# EAGLE board C64_2 (EAGLE 5.12)
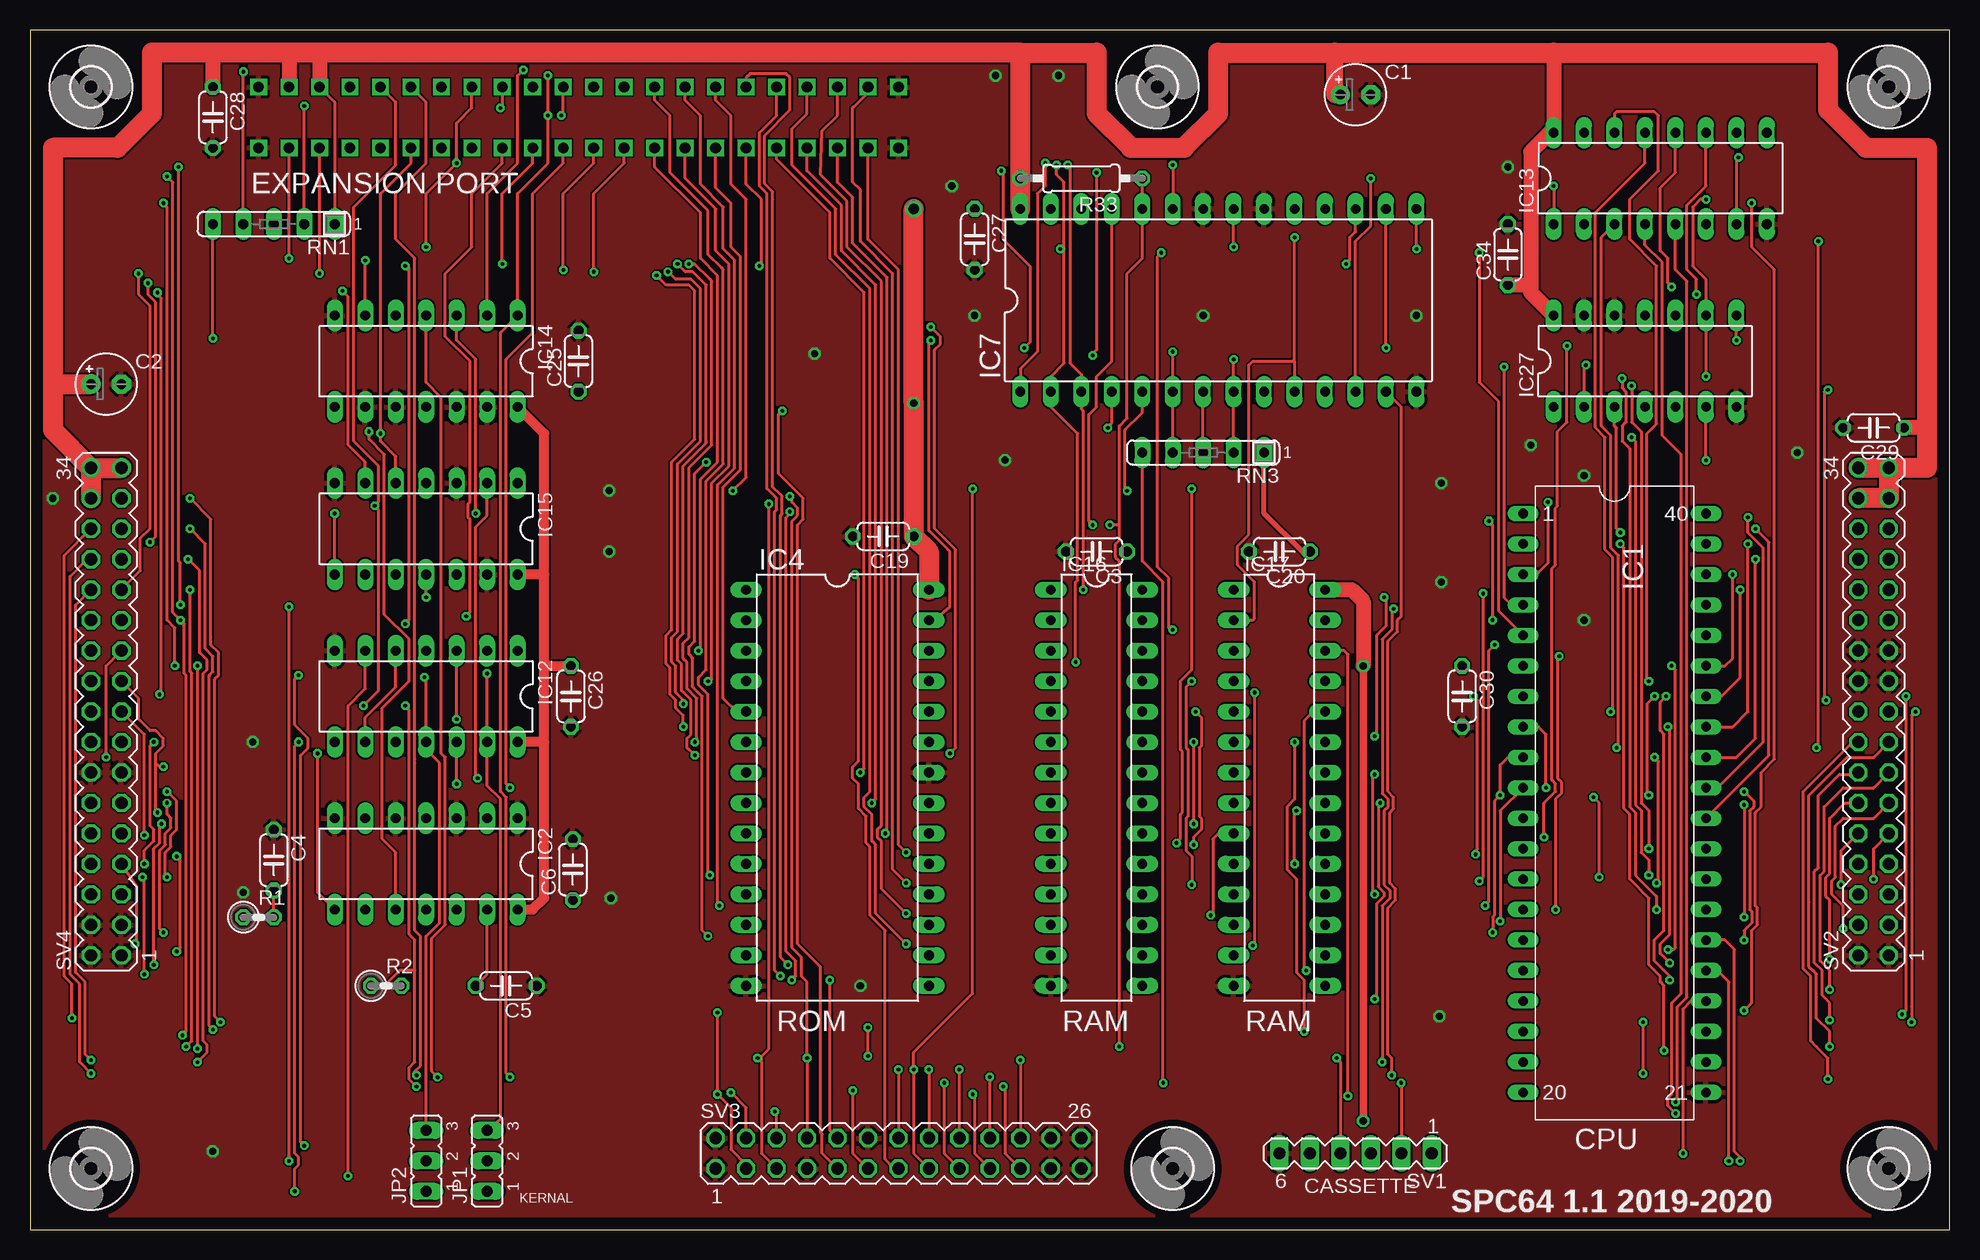
[diagram p5: board, top side]
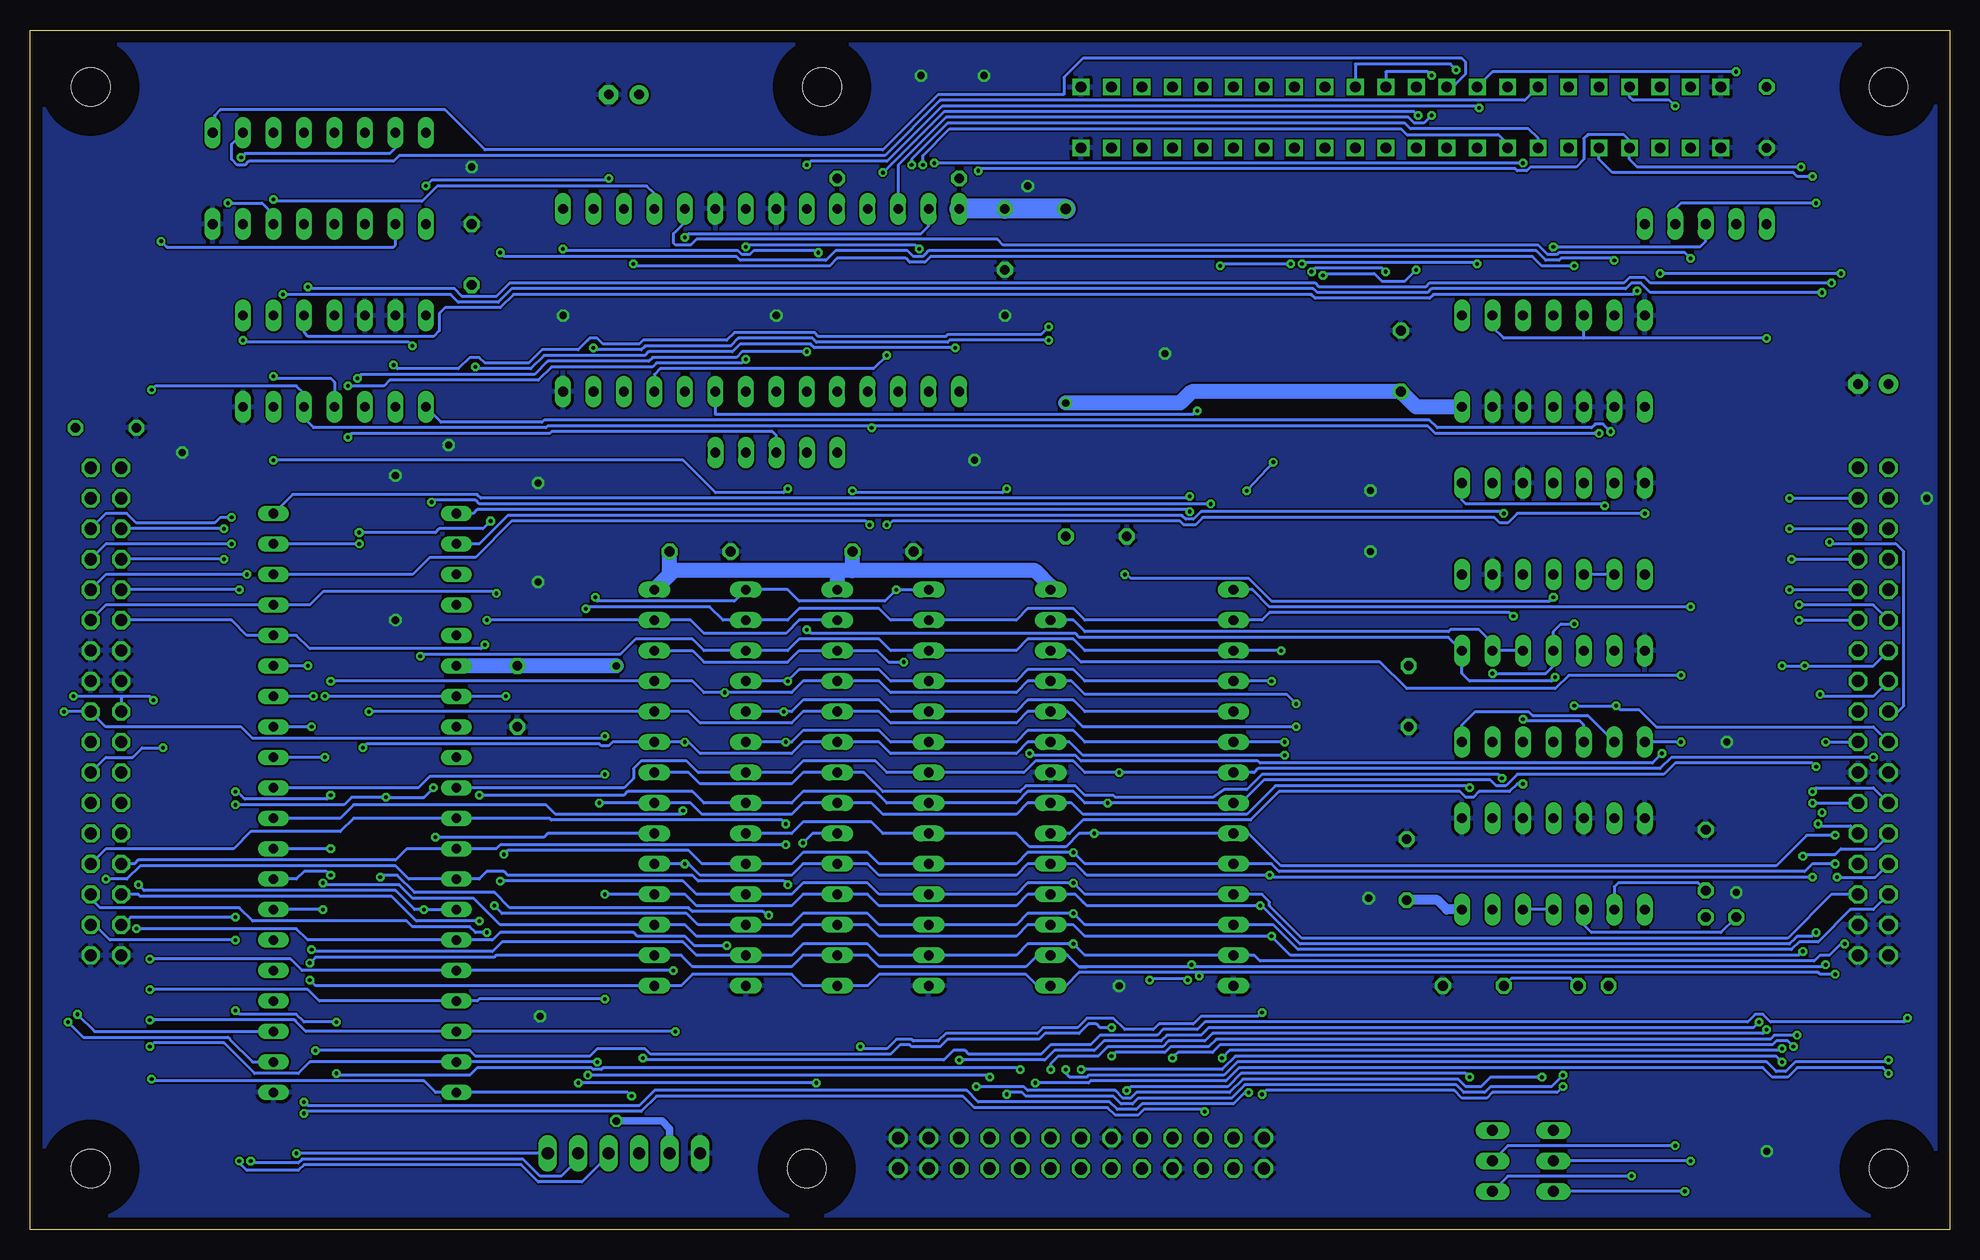
[diagram p6: board, bottom side, seen from below]

Size 160 x 100 mm. Coordinates in mm from the lower left corner, seen from the top.
Outline: 0,0 160,0 160,100 0,100 0,0
Copper layers (1*16): Top 0.035mm / dielectric 1.5mm / Bottom 0.035mm
Design rules "default *": minimum track width 10mil, minimum drill 12mil, track to track 6mil, track to pad 6mil, pad to pad 6mil, via to via 6mil, smd to smd 6mil, copper to edge 40mil, drill to drill 8mil, minimum pad ring 10mil, minimum via ring 8mil, stop-mask expansion 4mil, vias tented up to drill 0mil, thermal gap 10mil

## Footprints (pad centres in the part's own frame; a part is rotated, then mirrored left to right if it is on the bottom)
E2,5-5 = drill 0.813 pad 1.6 round: + -1.27,0 | drill 0.813 pad 1.6 octagon: - 1.27,0
C050-024X044 = drill 0.813 octagon: 1 -2.54,0; 2 2.54,0
EXPANSIONPORT = drill 0.9 square: 1 -26.67,2.54; 2 -24.13,2.54; 3 -21.59,2.54; 4 -19.05,2.54; 5 -16.51,2.54; 6 -13.97,2.54; 7 -11.43,2.54; 8 -8.89,2.54; 9 -6.35,2.54; 10 -3.81,2.54; 11 -1.27,2.54; 12 1.27,2.54; 13 3.81,2.54; 14 6.35,2.54; 15 8.89,2.54; 16 11.43,2.54; 17 13.97,2.54; 18 16.51,2.54; 19 19.05,2.54; 20 21.59,2.54; 21 24.13,2.54; 22 26.67,2.54; A -26.67,-2.54; B -24.13,-2.54; C -21.59,-2.54; D -19.05,-2.54; E -16.51,-2.54; F -13.97,-2.54; H -11.43,-2.54; J -8.89,-2.54; K -6.35,-2.54; L -3.81,-2.54; M -1.27,-2.54; N 1.27,-2.54; P 3.81,-2.54; R 6.35,-2.54; S 8.89,-2.54; T 11.43,-2.54; U 13.97,-2.54; V 16.51,-2.54; W 19.05,-2.54; X 21.59,-2.54; Y 24.13,-2.54; Z 26.67,-2.54
DIP40 = drill 0.8 pad 1.27 long: 1 -24.13,-7.62; 2 -21.59,-7.62; 3 -19.05,-7.62; 4 -16.51,-7.62; 5 -13.97,-7.62; 6 -11.43,-7.62; 7 -8.89,-7.62; 8 -6.35,-7.62; 9 -3.81,-7.62; 10 -1.27,-7.62; 11 1.27,-7.62; 12 3.81,-7.62; 13 6.35,-7.62; 14 8.89,-7.62; 15 11.43,-7.62; 16 13.97,-7.62; 17 16.51,-7.62; 18 19.05,-7.62; 19 21.59,-7.62; 20 24.13,-7.62; 21 24.13,7.62; 22 21.59,7.62; 23 19.05,7.62; 24 16.51,7.62; 25 13.97,7.62; 26 11.43,7.62; 27 8.89,7.62; 28 6.35,7.62; 29 3.81,7.62; 30 1.27,7.62; 31 -1.27,7.62; 32 -3.81,7.62; 33 -6.35,7.62; 34 -8.89,7.62; 35 -11.43,7.62; 36 -13.97,7.62; 37 -16.51,7.62; 38 -19.05,7.62; 39 -21.59,7.62; 40 -24.13,7.62
DIL14 = drill 0.813 long: 1 -7.62,-3.81; 2 -5.08,-3.81; 3 -2.54,-3.81; 4 0,-3.81; 5 2.54,-3.81; 6 5.08,-3.81; 7 7.62,-3.81; 8 7.62,3.81; 9 5.08,3.81; 10 2.54,3.81; 11 0,3.81; 12 -2.54,3.81; 13 -5.08,3.81; 14 -7.62,3.81
DIL28 = drill 0.813 long: 1 -16.51,-7.62; 2 -13.97,-7.62; 3 -11.43,-7.62; 4 -8.89,-7.62; 5 -6.35,-7.62; 6 -3.81,-7.62; 7 -1.27,-7.62; 8 1.27,-7.62; 9 3.81,-7.62; 10 6.35,-7.62; 11 8.89,-7.62; 12 11.43,-7.62; 13 13.97,-7.62; 14 16.51,-7.62; 15 16.51,7.62; 16 13.97,7.62; 17 11.43,7.62; 18 8.89,7.62; 19 6.35,7.62; 20 3.81,7.62; 21 1.27,7.62; 22 -1.27,7.62; 23 -3.81,7.62; 24 -6.35,7.62; 25 -8.89,7.62; 26 -11.43,7.62; 27 -13.97,7.62; 28 -16.51,7.62
DIL16 = drill 0.813 long: 1 -8.89,-3.81; 2 -6.35,-3.81; 3 -3.81,-3.81; 4 -1.27,-3.81; 5 1.27,-3.81; 6 3.81,-3.81; 7 6.35,-3.81; 8 8.89,-3.81; 9 8.89,3.81; 10 6.35,3.81; 11 3.81,3.81; 12 1.27,3.81; 13 -1.27,3.81; 14 -3.81,3.81; 15 -6.35,3.81; 16 -8.89,3.81
DIL28-3 = drill 0.813 long: 1 -16.51,-3.81; 2 -13.97,-3.81; 3 -11.43,-3.81; 4 -8.89,-3.81; 5 -6.35,-3.81; 6 -3.81,-3.81; 7 -1.27,-3.81; 8 1.27,-3.81; 9 3.81,-3.81; 10 6.35,-3.81; 11 8.89,-3.81; 12 11.43,-3.81; 13 13.97,-3.81; 14 16.51,-3.81; 15 16.51,3.81; 16 13.97,3.81; 17 11.43,3.81; 18 8.89,3.81; 19 6.35,3.81; 20 3.81,3.81; 21 1.27,3.81; 22 -1.27,3.81; 23 -3.81,3.81; 24 -6.35,3.81; 25 -8.89,3.81; 26 -11.43,3.81; 27 -13.97,3.81; 28 -16.51,3.81
JP2 = drill 0.914 long: 1 -2.54,0; 2 0,0; 3 2.54,0
0207/2V = drill 0.813 octagon: 1 -1.27,0; 2 1.27,0
0207/10 = drill 0.813 octagon: 1 -5.08,0; 2 5.08,0
SIL5 = drill 0.813 long: 1 -5.08,0; 2 -2.54,0; 3 0,0; 4 2.54,0; 5 5.08,0
MA06-1 = drill 1.016 long: 1 -6.35,0; 2 -3.81,0; 3 -1.27,0; 4 1.27,0; 5 3.81,0; 6 6.35,0
MA17-2 = drill 1.016 octagon: 1 -20.32,-1.27; 2 -20.32,1.27; 3 -17.78,-1.27; 4 -17.78,1.27; 5 -15.24,-1.27; 6 -15.24,1.27; 7 -12.7,-1.27; 8 -12.7,1.27; 9 -10.16,-1.27; 10 -10.16,1.27; 11 -7.62,-1.27; 12 -7.62,1.27; 13 -5.08,-1.27; 14 -5.08,1.27; 15 -2.54,-1.27; 16 -2.54,1.27; 17 0,-1.27; 18 0,1.27; 19 2.54,-1.27; 20 2.54,1.27; 21 5.08,-1.27; 22 5.08,1.27; 23 7.62,-1.27; 24 7.62,1.27; 25 10.16,-1.27; 26 10.16,1.27; 27 12.7,-1.27; 28 12.7,1.27; 29 15.24,-1.27; 30 15.24,1.27; 31 17.78,-1.27; 32 17.78,1.27; 33 20.32,-1.27; 34 20.32,1.27
MA13-2 = drill 1.016 octagon: 1 -15.24,-1.27; 2 -15.24,1.27; 3 -12.7,-1.27; 4 -12.7,1.27; 5 -10.16,-1.27; 6 -10.16,1.27; 7 -7.62,-1.27; 8 -7.62,1.27; 9 -5.08,-1.27; 10 -5.08,1.27; 11 -2.54,-1.27; 12 -2.54,1.27; 13 0,-1.27; 14 0,1.27; 15 2.54,-1.27; 16 2.54,1.27; 17 5.08,-1.27; 18 5.08,1.27; 19 7.62,-1.27; 20 7.62,1.27; 21 10.16,-1.27; 22 10.16,1.27; 23 12.7,-1.27; 24 12.7,1.27; 25 15.24,-1.27; 26 15.24,1.27
3,2 = hole 3.2: 0,0

## Placement (x,y rotation side)
C1  10µ  [E2,5-5]  110.49,94.61 0 top
C2  10µ  [E2,5-5]  6.35,70.48 0 top
C3  100n  [C050-024X044]  88.9,56.52 180 top
C4  100p  [C050-024X044]  20.32,30.8 270 top
C5  200p  [C050-024X044]  39.69,20.32 180 top
C6  100n  [C050-024X044]  45.24,30 90 top
C19  100n  [C050-024X044]  71.12,57.78 180 top
C20  100n  [C050-024X044]  104.14,56.52 180 top
C25  100n  [C050-024X044]  45.72,72.39 90 top
C26  100n  [C050-024X044]  45.09,44.45 270 top
C27  100n  [C050-024X044]  78.74,82.55 270 top
C28  100n  [C050-024X044]  15.24,92.71 270 top
C29  100n  [C050-024X044]  153.67,66.83 180 top
C30  100n  [C050-024X044]  119.38,44.45 270 top
C34  100n  [C050-024X044]  123.19,81.28 90 top
CN1  EXPANSIONPORT-C64  [EXPANSIONPORT]  45.72,92.71 0 top
IC1  6510 CPU  [DIP40]  132.08,35.56 270 top
IC2  74HC14  [DIL14]  33.02,30.48 180 top
IC4  27C512  [DIL28]  67.31,36.83 270 top
IC7  27C512  [DIL28]  99.06,77.47 0 top
IC12  74HC11  [DIL14]  33.02,44.45 180 top
IC13  74HC139  [DIL16]  135.89,87.63 0 top
IC14  74HC08  [DIL14]  33.02,72.39 180 top
IC15  74HC04  [DIL14]  33.02,58.42 180 top
IC16  61256  [DIL28-3]  88.9,36.83 270 top
IC17  61256  [DIL28-3]  104.14,36.83 270 top
IC27  74HC32  [DIL14]  134.62,72.39 0 top
JP1  rsel1  [JP2]  38.1,5.71 90 top
JP2  rsel2  [JP2]  33.02,5.71 90 top
R1  560  [0207/2V]  19.05,26.04 0 top
R2  1K5  [0207/2V]  29.69,20.32 0 top
R33  1K5  [0207/10]  87.63,87.63 180 top
RN1  3K3  [SIL5]  20.32,83.82 180 top
RN3  3K3  [SIL5]  97.79,64.77 180 top
SV1  CASS  [MA06-1]  110.49,6.35 180 top
SV2  board 1  [MA17-2]  153.67,43.18 90 top
SV3  board 1  [MA13-2]  72.39,6.35 0 top
SV4  board 3  [MA17-2]  6.35,43.18 90 top
U$1  [3,2]  5.08,95.25 0 top
U$2  [3,2]  5.08,5.08 0 top
U$3  [3,2]  154.94,5.08 0 top
U$4  [3,2]  154.94,95.25 0 top
U$5  [3,2]  93.98,95.25 0 top
U$6  [3,2]  95.25,5.08 0 top

## Tracks (layer width: path | path; a pad name or v marks a point on that pad's centre or on a via)
/A15  (via drill 0.3)
  Top 0.254: IC15.6 27.94,63.98 26.51,65.41 26.51,77.79 v26.04,78.26
  Bottom 0.254: v26.04,78.26 26.35,77.95 43.02,77.95 43.34,77.63 52.86,77.63 53.18,77.95 119.7,77.95 120.81,76.83 125.41,76.83 125.89,76.36 125.89,74.93 126.36,74.45 128.59,74.45 129.22,74.45 136.84,74.45 137.16,74.77 IC27.10
/AEC  (via drill 0.32)
  Top 0.254: SV3.13 72.07,5.08 71.28,5.87 71.28,24.92 70.01,26.19 70.01,31.91 69.69,32.23 69.69,34.45 69.06,35.08 69.06,37.15 68.58,37.62 68.58,38.58 69.06,39.05 69.06,54.29 v68.74,54.61 | v33.02,52.7 IC15.11
  Bottom 0.254: v68.74,54.61 68.58,54.61 68.26,54.29 58.42,54.29 56.52,52.39 33.34,52.39 v33.02,52.7
/BASIC  (via drill 0.3)
  Top 0.254: v38.1,46.35 IC12.13 38.1,36.99 39.21,35.88 39.21,9.21 JP1.3 | IC7.17 110.49,83.19 110.01,82.71 110.01,80.8 v109.7,80.49 | v31.27,80.33 31.43,80.33 31.59,80.17 31.59,50.8 v31.27,50.48
  Bottom 0.254: v38.1,46.35 33.66,46.35 33.02,46.99 IC12.4 33.02,49.85 32.38,50.48 v31.27,50.48 | v109.7,80.49 109.54,80.33 93.34,80.33 92.71,80.96 87,80.96 86.68,80.64 85.41,80.64 84.93,81.12 34.77,81.12 33.97,80.33 v31.27,80.33
/CAS  (via drill 0.3)
  Top 0.254: v62.71,68.26 62.39,67.94 62.39,63.02 64.45,60.96 64.45,59.21 63.98,58.74 63.98,23.81 65.88,21.91 65.88,10.16 65.88,8.1 66.04,7.94 66.04,6.35 SV3.9 | v62.71,68.26
  Bottom 0.254: v62.71,68.26 63.02,67.94 102.87,67.94 IC7.9
/CASRAM  (via drill 0.3)
  Top 0.254: v139.7,71.12 IC27.9 139.7,79.22 138.59,80.33 138.59,85.25 139.22,85.88 v139.7,85.88
  Bottom 0.254: IC7.18 107.95,86.36 108.58,87 126.05,87 126.84,86.2 | IC27.4 134.62,70.64 134.94,70.96 139.54,70.96 v139.7,71.12 | 126.84,86.2 | 126.84,86.2 127.32,85.72 139.54,85.72 v139.7,85.88
/CHAREN  (via drill 0.3)
  Top 0.254: RN3.4 IC7.6 v95.25,73.18 | v135.57,26.67 135.57,27.78 133.83,29.53 133.83,34.77 133.35,35.24 133.35,65.09 132.72,65.72 132.72,66.99 133.03,67.31 133.03,69.85 132.72,70.17 v132.72,70.96
  Bottom 0.254: v135.57,26.67 IC1.27 | v132.72,70.96 132.4,71.28 117.95,71.28 116.84,72.39 108.43,72.39 108.11,72.71 101.12,72.71 100.65,73.18 v95.25,73.18
/CHAROM  (via drill 0.3)
  Top 0.254: v32.86,46.04 33.02,45.88 IC12.11 33.02,40.01 34.13,38.89 34.13,25.56 33.02,24.45 JP2.3 | v95.25,50.01 95.09,50.01 94.93,50.16 94.93,54.29 93.98,55.24 93.98,81.12 v94.3,81.44 | v115.57,81.76 IC7.15
  Bottom 0.254: v32.86,46.04 33.18,45.72 40.01,45.72 40.64,46.35 IC12.1 41.75,49.37 72.55,49.37 72.87,49.69 94.93,49.69 v95.25,50.01 | v94.3,81.44 94.46,81.6 99.69,81.6 100.01,81.28 100.65,81.28 100.97,81.6 115.41,81.6 v115.57,81.76
/CIA1  (via drill 0.3)
  Top 0.254: IC13.12 137.16,88.11 135.89,86.84 135.89,81.6 136.53,80.96 136.53,78.9 v136.84,78.58 | v9.84,78.9 9.84,77.95 10.48,77.31 10.48,57.78 v10,57.31
  Bottom 0.254: v136.84,78.58 | v136.84,78.58 136.68,78.42 124.62,78.42 123.98,77.79 121.13,77.79 120.02,78.9 52.86,78.9 52.55,78.58 43.66,78.58 43.34,78.9 27.15,78.9 26.67,79.38 25.4,79.38 24.92,78.9 v9.84,78.9 | SV4.18 4.29,43.18 3.81,43.66 3.81,56.52 4.45,57.15 9.84,57.15 v10,57.31
/CIA2  (via drill 0.3)
  Top 0.254: IC13.11 139.7,87 138.43,85.72 138.11,85.41 138.11,80.01 138.91,79.22 v138.91,77.95 | v10.64,78.11 10.64,77.95 10.95,77.63 10.95,44.77 v10.79,44.61
  Bottom 0.254: v138.91,77.95 124.94,77.95 124.3,77.31 120.97,77.31 119.86,78.42 53.02,78.42 52.7,78.11 43.5,78.11 43.18,78.42 26.99,78.42 26.51,78.9 25.72,78.9 24.92,78.11 v10.64,78.11 | v10.79,44.61 | v10.79,44.61 10.64,44.45 6.35,44.45 SV4.20
/CIAS  (via drill 0.3)
  Top 0.254: v142.4,89.38 142.24,89.22 IC13.7
  Bottom 0.254: IC13.15 129.54,90.17 130.02,89.69 142.08,89.69 v142.4,89.38
/COLOR  (via drill 0.3)
  Top 0.254: SV3.18 v77.47,13.34 | v134.46,13.02 v134.46,17.3 | v142.88,18.26 143.51,18.89 143.51,24.92 143.83,25.24 143.99,25.4 143.99,26.83 143.83,26.99 143.83,34.77 144.3,35.24 144.3,38.1 145.41,39.21 145.41,80.01 143.51,81.92 v143.51,85.57
  Bottom 0.254: v77.47,13.34 77.63,13.49 81.76,13.49 82.07,13.49 112.24,13.49 112.39,13.34 113.03,13.34 113.19,13.49 122.71,13.49 123.35,12.86 134.3,12.86 v134.46,13.02 | v134.46,17.3 137.16,17.3 137.79,17.94 142.56,17.94 v142.88,18.26 | v143.51,85.57 140.65,85.57 139.7,84.61 IC13.6
/CS_HIRAM  (via drill 0.3)
  Top 0.254: v126.21,32.7 126.21,35.56 127.16,36.51 127.16,37.15 126.84,37.47 126.84,55.09 127.16,55.4 127.16,60.17 127.32,60.33 127.32,66.52 128.11,67.31 v128.11,73.66 | v142.24,74.14 IC27.8
  Bottom 0.254: IC17.20 116.84,33.02 117,32.86 | 117,32.86 | 117,32.86 117.16,32.7 v126.21,32.7 | v128.11,73.66 128.43,73.98 142.08,73.98 v142.24,74.14
/CS_LORAM  (via drill 0.3)
  Top 0.254: v95.57,32.23 95.89,32.54 95.89,34.61 96.04,34.77 96.04,39.85 95.89,40.01 95.89,45.72 96.84,46.67 v96.84,61.75 | v139.7,64.14 IC27.6
  Bottom 0.254: IC16.20 94.77,33.02 v95.57,32.23 | v96.84,61.75 97.16,61.44 102.87,61.44 105.57,64.14 v139.7,64.14
/DMA  (via drill 0.3)
  Top 0.254: v15.24,74.3 RN1.5 | IC14.2 38.1,86.36 40.64,88.9 40.64,96.2 v41.12,96.68 | v41.12,96.68
  Bottom 0.254: 30.48,74.3 IC14.5 30.48,75.25 | 30.48,74.3 37.15,74.3 38.1,75.25 IC14.2 | v15.24,74.3 30.48,74.3 | v41.12,96.68 41.59,97.16 49.53,97.16 CN1.13
/EXROM  (via drill 0.3)
  Top 0.254: RN1.4 v17.78,96.52 | CN1.9 39.37,93.66 v39.21,93.5 | v95.25,88.74 95.25,85.25 IC7.23
  Bottom 0.254: v17.78,96.52 38.1,96.52 CN1.9 | v39.21,93.5 39.37,93.66 83.98,93.66 88.58,89.06 94.93,89.06 v95.25,88.74
/GAME  (via drill 0.3)
  Top 0.254: CN1.8 36.83,93.5 35.56,92.23 v35.56,88.9 33.02,86.36 v33.02,81.92 | v84.61,88.9 84.61,87 83.98,86.36 83.98,73.18 82.55,71.75 IC7.1
  Bottom 0.254: v33.02,81.92 20.8,81.92 20.32,82.39 RN1.3 | v35.56,88.9 v84.61,88.9
/HIRAM  (via drill 0.3)
  Top 0.254: RN3.3 IC7.7 | v134.94,29.53 134.94,30.8 134.3,31.43 134.3,34.92 133.83,35.4 133.83,65.72 v133.51,66.04
  Bottom 0.254: IC1.28 137.79,29.21 137.16,29.84 135.25,29.84 v134.94,29.53 | v133.51,66.04 133.19,66.36 116.68,66.36 116.52,66.52 98.11,66.52 97.79,66.2 RN3.3
/I/O  (via drill 0.3)
  Top 0.254: IC7.12 110.49,82.39 111.76,83.66 v111.76,87.63 | v127,87 IC13.1
  Bottom 0.254: v111.76,87.63 111.92,87.47 126.52,87.47 v127,87
/IRQ  (via drill 0.3)
  Top 0.254: v13.97,15.08 v13.97,46.99 | v60.64,14.29 60.96,13.97 | 60.96,13.97 60.96,6.35 SV3.5 | 60.96,13.97 60.96,14.45 61.59,15.08 v61.59,60.48 | v126.52,60.64 126.52,55.56 125.57,54.61 IC1.3 | v12.06,46.99 12.06,50.16 11.43,50.8 11.43,85.25 v11.11,85.57 | RN1.2 v22.86,93.66
  Bottom 0.254: SV4.22 6.35,46.99 v12.06,46.99 v13.97,46.99 | v13.97,15.08 | v13.97,15.08 14.13,14.92 60.01,14.92 v60.64,14.29 | v61.59,60.48 122.56,60.48 122.87,60.8 126.36,60.8 v126.52,60.64 | v11.11,85.57 22.38,85.57 22.86,85.09 RN1.2 | CN1.4 26.67,94.46 26.35,94.14 23.34,94.14 v22.86,93.66
/KERNAL  (via drill 0.3)
  Top 0.254: v35.56,42.55 IC12.3 | IC4.27 75.41,50.8 76.68,51.91 76.68,56.52 76.52,56.67 74.93,58.26 74.93,73.98 v75.09,74.14 | v113.03,73.5 IC7.16
  Bottom 0.254: IC12.3 IC12.2 38.1,48.9 39.21,50.01 41.59,50.01 41.75,49.85 72.07,49.85 73.03,50.8 IC4.27 | v35.56,42.55 35.4,42.39 30.8,42.39 30.48,42.07 IC12.10 | v75.09,74.14 83.34,74.14 83.5,73.98 94.46,73.98 94.61,74.14 | 94.61,74.14 | 94.61,74.14 94.77,74.3 100.97,74.3 101.6,73.66 108.74,73.66 109.06,73.34 112.71,73.34 v113.03,73.5
/LORAM  (via drill 0.3)
  Top 0.254: RN3.2 IC7.8 100.33,69.53 v100.33,72.55 | v134.94,31.75 134.94,34.92 134.3,35.56 134.3,66.52 133.67,67.15 | 133.67,67.15 | 133.67,67.15 133.51,67.31 v133.51,70.33
  Bottom 0.254: v134.94,31.75 IC1.29 | v133.51,70.33 131.6,70.33 130.49,70.33 130.02,70.8 117.63,70.8 116.52,71.91 108.11,71.91 107.79,72.23 100.65,72.23 v100.33,72.55
/NMI  (via drill 0.3)
  Top 0.254: v12.54,52.07 12.54,55.56 12.38,55.72 v12.38,88.58 | v80.96,88.27 | v80.96,88.27 81.12,88.11 81.12,82.55 83.34,80.33 83.34,73.98 v82.87,73.5 | v122.87,71.91 122.87,61.75 122.87,61.59 122.87,52.7 123.51,52.07 IC1.4
  Bottom 0.254: SV4.24 6.35,52.07 v12.54,52.07 | v12.38,88.58 26.04,88.58 26.67,89.22 CN1.D 26.67,90.81 27.15,91.28 30.16,91.28 30.48,90.96 30.48,89.22 31.11,88.58 34.92,88.58 35.24,88.27 36.04,88.27 36.2,88.42 80.8,88.42 v80.96,88.27 | v82.87,73.5 94.61,73.5 94.93,73.82 100.81,73.82 101.44,73.18 108.43,73.18 108.74,72.87 117.16,72.87 118.27,71.75 122.87,71.75 v122.87,71.91
/OE_RAM  (via drill 0.3)
  Top 0.254: v37.31,37.62 | v37.31,37.62 37.15,37.78 37.15,58.58 38.1,59.53 IC15.2
  Bottom 0.254: IC17.22 105.09,38.1 104.14,37.15 96.52,37.15 95.57,38.1 IC16.22 90.49,38.1 88.9,36.51 77.47,36.51 76.99,36.99 72.87,36.99 72.07,36.2 69.69,36.2 69.53,36.04 61.44,36.04 60.48,36.67 58.58,36.67 57.63,37.62 57.31,37.94 37.62,37.94 v37.31,37.62
/PAL_AEC  (via drill 0.32)
  Top 0.254: IC7.25 90.17,72.39 88.9,71.12 88.9,68.58 88.27,67.94 88.27,59.05 v88.58,58.74 | IC15.8 v25.4,59.69
  Bottom 0.254: v88.58,58.74 88.42,58.74 88.11,59.05 64.14,59.05 63.82,58.74 62.87,58.74 62.23,59.37 37.94,59.37 37.47,58.9 36.83,58.9 36.04,59.69 v25.4,59.69
/RAM_WE  (via drill 0.32)
  Top 0.254: IC27.3 132.08,66.99 132.24,66.83 132.24,58.42 v132.56,58.1 | v121.6,59.05 121.92,58.74 v121.92,50.8
  Bottom 0.254: IC16.27 95.89,50.8 97,49.69 103.82,49.69 104.93,50.8 IC17.27 v121.92,50.8 | v132.56,58.1 126.21,58.1 125.89,58.42 122.24,58.42 v121.6,59.05
/RESET  (via drill 0.3)
  Top 0.254: SV3.8 v64.77,14.29 64.77,20.64 64.29,21.11 64.29,22.7 63.5,23.5 63.5,59.05 63.98,59.53 63.98,60.17 63.5,60.64 63.5,60.96 v63.34,61.12 | v13.02,15.24 13.49,15.72 13.49,46.35 13.34,46.51 v13.34,53.34 | v9.05,79.69 9.05,77.95 10,76.99 10,58.42 9.21,57.63 9.21,54.93 SV4.25 | v24.13,79.69 CN1.C
  Bottom 0.254: v64.77,14.29 64.29,14.76 61.44,14.76 60.8,15.4 14.76,15.4 14.45,15.72 13.49,15.72 v13.02,15.24 | v13.34,53.34 SV4.25 | v9.05,79.69 v24.13,79.69 | v24.13,79.69 | v63.34,61.12 | v63.34,61.12 63.5,60.96 122.4,60.96 122.71,61.28 138.11,61.28 IC1.40
/ROM_CS  (via drill 0.32)
  Top 0.254: v35.56,37.15 IC12.12
  Bottom 0.254: IC4.20 73.34,33.02 72.23,34.13 58.26,34.13 55.88,36.51 40.8,36.51 40.32,36.04 39.69,36.04 39.21,36.51 36.67,36.51 36.04,37.15 v35.56,37.15
/ROMH  (via drill 0.3)
  Top 0.254: v21.59,80.96 CN1.B
  Bottom 0.254: IC7.19 105.41,83.98 106.36,83.03 106.36,82.23 106.2,82.07 104.93,82.07 104.62,82.39 | 104.62,82.39 | 104.62,82.39 104.46,82.55 79.38,82.55 78.9,82.07 34.29,82.07 33.5,81.28 32.7,81.28 32.54,81.44 22.07,81.44 v21.59,80.96
/ROML  (via drill 0.3)
  Top 0.254: CN1.11 44.45,93.03 v44.29,92.87 | v88.9,88.11 88.9,73.34 88.58,73.03 v88.58,72.87
  Bottom 0.254: v44.29,92.87 44.61,93.19 83.82,93.19 v88.9,88.11 | v88.58,72.87 89.69,71.75 107.47,71.75 107.95,71.28 IC7.11
/SID  (via drill 0.3)
  Top 0.254: SV3.4 59.69,10.16 v58.42,11.43 | v137.16,10.64 | v137.16,10.64 137.32,10.79 | IC13.5 137.16,80.01 138.11,79.06 138.11,19.37 137.32,18.57 137.32,10.79 | v137.16,10.64 137.32,10.79
  Bottom 0.254: v58.42,11.43 58.74,11.43 59.69,10.48 67.31,10.48 67.79,10 69.37,10 70.01,10.64 80.96,10.64 81.92,11.59 107.95,11.59 109.22,10.32 136.84,10.32 v137.16,10.64
/SRQ_IN  (via drill 0.3)
  Top 0.254: SV1.4 109.22,13.97 v108.9,14.29 | v3.49,17.62 3.49,20.48 2.86,21.11 2.86,56.2 SV4.30
  Bottom 0.254: v108.9,14.29 108.74,14.13 83.82,14.13 83.03,14.92 82.07,14.92 81.76,14.61 75.72,14.61 74.93,15.4 71.6,15.4 70.8,16.19 66.04,16.19 65.56,16.67 62.71,16.67 62.07,17.3 16.83,17.3 16.19,17.94 15.56,17.94 14.92,17.3 3.81,17.3 v3.49,17.62
/VA14  (via drill 0.3, 0.32)
  Top 0.254: SV3.15 73.66,6.35 v73.66,13.34 73.66,14.76 78.58,19.68 v78.58,61.75 | v5.08,14.13 | v5.08,14.13 4.6,14.61 4.6,20.64 3.81,21.43 3.81,52.07 SV4.26 | IC7.5 92.71,68.1 91.28,66.67 91.28,61.75 v91.44,61.59
  Bottom 0.254: v73.66,13.34 73.66,13.02 73.34,12.7 71.91,12.7 71.75,12.86 60.48,12.86 59.37,13.97 15.24,13.97 14.45,13.18 13.65,13.18 12.86,13.97 5.24,13.97 v5.08,14.13 | v91.44,61.59 91.28,61.44 78.9,61.44 v78.58,61.75
/VA15  (via drill 0.3)
  Top 0.254: SV4.28 4.76,55.88 3.33,54.45 3.33,21.27 4.13,20.48 4.13,13.97 v5.08,13.02 | v76.2,12.22 76.2,6.35 SV3.17
  Bottom 0.254: v5.08,13.02 | v5.08,13.02 5.56,13.49 12.7,13.49 13.49,12.7 14.76,12.7 15.56,13.49 22.7,13.49 23.97,13.49 28.73,13.49 30.32,13.49 59.21,13.49 60.33,12.38 71.6,12.38 71.75,12.22 v76.2,12.22
/VIC  (via drill 0.3)
  Top 0.254: SV3.6 62.23,9.68 v62.07,9.84 | v137.16,9.68 136.53,10.32 136.53,10.95 136.84,11.27 136.84,18.89 137.64,19.68 137.64,64.61 136.05,66.2 136.05,80.64 134.62,82.07 IC13.4
  Bottom 0.254: v62.07,9.84 62.23,10 67.15,10 67.63,9.53 69.53,9.53 70.17,10.16 81.28,10.16 82.23,11.11 107.79,11.11 109.06,9.84 137,9.84 v137.16,9.68
A0  (via drill 0.3)
  Top 0.254: v9.53,30.48 9.53,31.59 10.32,32.38 10.32,33.34 10,33.66 10,40.32 v10.32,40.64 | v73.03,31.43 72.39,32.07 72.39,80.01 69.85,82.55 CN1.Y | v142.88,24.13 142.88,24.92 143.51,25.56 143.51,26.51 143.35,26.67 143.35,34.92 143.67,35.24 143.67,35.72 v142.88,36.51 | v134.94,36.2 | v134.94,36.2 134.78,36.35 134.78,43.81 v135.41,44.45 | v135.41,44.45 | v120.49,31.27 120.65,31.75 120.65,44.13 v120.33,44.45
  Bottom 0.254: v9.53,30.48 11.43,30.48 12.06,29.84 55.88,29.84 56.52,30.48 IC4.10 72.07,30.48 v73.03,31.43 76.83,31.43 77.79,30.48 IC16.10 89.22,30.48 90.17,31.43 95.57,31.43 96.52,30.48 IC17.10 103.98,30.48 105.09,31.59 120.17,31.59 v120.49,31.27 | v10.32,40.64 SV4.15 | SV2.3 154.62,25.4 153.35,24.13 v142.88,24.13 | v142.88,36.51 142.72,36.51 142.24,36.04 | 142.24,36.04 | 142.24,36.04 142.08,35.88 135.25,35.88 v134.94,36.2 | v135.41,44.45 IC1.7 v120.33,44.45
A1  (via drill 0.3)
  Top 0.254: CN1.X 67.31,87.31 68.58,86.04 68.58,82.23 71.44,79.38 71.44,33.18 v71.28,33.02 | v9.53,32.86 9.53,41.27 SV4.17 | v142.88,35.4 v142.88,26.04 | v126.36,36.83 126.36,41.27 125.73,41.91 IC1.8 | IC17.9 99.06,33.02 98.58,32.54 98.58,26.35 v98.42,26.19 | v130.81,29.37 130.81,35.56 v130.33,36.04
  Bottom 0.254: IC17.9 96.52,33.02 95.57,33.97 89.85,33.97 88.9,33.02 IC16.9 77.79,33.02 76.68,31.91 73.66,31.91 72.55,33.02 v71.28,33.02 IC4.9 58.42,33.02 55.72,30.32 14.45,30.32 11.91,32.86 v9.53,32.86 | SV2.4 152.24,25.4 151.61,26.04 v142.88,26.04 | v142.88,35.4 133.83,35.4 133.19,36.04 v130.33,36.04 127.16,36.04 v126.36,36.83 | v98.42,26.19 98.58,26.19 98.9,26.51 104.78,26.51 105.09,26.83 120.02,26.83 121.28,28.1 127.95,28.1 129.38,29.53 130.65,29.53 v130.81,29.37
A2  (via drill 0.3, 0.32)
  Top 0.254: CN1.W 64.77,88.27 67.63,85.41 67.63,81.6 70.48,78.74 70.48,35.88 v70.17,35.56 | IC1.9 123.19,39.37 122.56,38.73 v122.56,36.2 122.08,35.72 122.08,26.19 121.92,26.04 v121.92,24.77 | v10.64,34.77 | v10.64,34.77 10.48,34.92 10.48,38.89 | 10.48,38.89 10.48,39.69 11.11,40.32 11.11,40.96 10.48,41.59 10,41.59 9.05,42.55 9.05,44.29 SV4.19 | v11.11,38.58 10.79,38.58 10.48,38.89
  Bottom 0.254: v122.56,36.2 110.49,36.2 110.17,36.51 104.78,36.51 103.82,35.56 IC17.8 96.52,35.56 95.57,36.51 89.53,36.51 88.58,35.56 IC16.8 77.79,35.56 76.83,36.51 73.03,36.51 72.07,35.56 v70.17,35.56 IC4.8 59.05,35.56 57.15,37.47 38.26,37.47 37.78,36.99 36.99,36.99 36.04,37.94 23.81,37.94 22.86,38.89 11.43,38.89 v11.11,38.58 | SV2.5 154.94,27.62 154.15,26.83 142.56,26.83 141.45,25.72 128.59,25.72 128.11,25.24 123.35,25.24 122.87,24.77 v121.92,24.77
A3  (via drill 0.3)
  Top 0.254: CN1.V 62.23,89.22 66.67,84.77 66.67,80.96 69.53,78.11 69.53,38.42 v69.22,38.1 | v6.35,39.37 6.35,46.99 SV4.21 | v122.56,25.72 122.56,34.92 IC1.10
  Bottom 0.254: IC1.10 110.49,36.83 109.7,37.62 109.7,38.42 109.06,39.05 105.25,39.05 104.3,38.1 IC17.7 96.52,38.1 95.57,39.05 89.53,39.05 88.58,38.1 IC16.7 77.15,38.1 76.2,39.05 73.03,39.05 72.07,38.1 v69.22,38.1 IC4.7 57.94,38.1 57.63,38.42 24.13,38.42 23.18,39.37 v6.35,39.37 | SV2.6 150.97,27.94 150.81,27.78 129.86,27.78 127.79,25.72 v122.56,25.72
A4  (via drill 0.3)
  Top 0.254: CN1.U 59.69,87.15 60.96,85.88 60.96,80.49 v60.8,80.33 60.96,80.64 | v97,40.64 v97,33.81 | v54.93,80.49 55.4,80.49 56.67,79.22 | 56.67,79.22 | 56.67,79.22 56.83,79.06 56.83,65.41 54.93,63.5 54.93,49.37 54.45,48.9 54.45,47.62 54.77,47.31 54.77,45.09 55.56,44.29 55.56,40.96 v55.4,40.64
  Bottom 0.254: IC17.6 v97,40.64 96.52,40.64 95.57,41.59 89.22,41.59 88.27,40.64 IC16.6 77.79,40.64 76.83,41.59 73.03,41.59 72.07,40.64 IC4.6 v55.4,40.64 | v97,33.81 97.31,34.13 116.52,34.13 116.68,34.29 IC1.11 133.03,34.29 134.14,33.18 141.6,33.18 143.03,31.75 153.67,31.75 SV2.7 | 60.64,80.49 v60.8,80.33 | 60.64,80.49 | v54.93,80.49 60.64,80.49
A5  (via drill 0.3)
  Top 0.254: CN1.T 57.15,86.84 58.42,85.57 58.42,81.92 59.21,81.12 59.21,63.34 57.78,61.91 57.78,44.29 58.9,43.18 IC4.5 | v97,32.07 97,32.7 97.63,33.34 97.63,34.29 97.47,34.45 97.47,40.16 97.63,40.32 97.63,42.7 v97.16,43.18
  Bottom 0.254: IC4.5 72.07,43.18 73.03,44.13 76.83,44.13 77.79,43.18 IC16.5 88.27,43.18 89.22,44.13 95.57,44.13 96.52,43.18 v97.16,43.18 IC17.5 | SV2.8 151.29,30.48 150.97,30.8 129.54,30.8 128.59,31.75 IC1.12 121.13,31.75 120.81,32.07 v97,32.07
A6  (via drill 0.3)
  Top 0.254: CN1.S 54.61,87.63 57.15,85.09 57.15,81.6 | v153.67,29.21 153.67,31.75 SV2.9 | v56.52,45.72 56.83,45.88 56.83,62.23 58.26,63.66 58.26,80.49 57.15,81.6 | v96.84,28.73 96.84,31.11 96.36,31.59 96.36,34.29 96.52,34.45 96.52,40.01 96.36,40.16 96.36,45.24 v96.84,45.72 | 57.15,81.6
  Bottom 0.254: IC17.4 v96.84,45.72 95.89,46.67 89.22,46.67 88.27,45.72 IC16.4 77.79,45.72 76.83,46.67 73.03,46.67 72.07,45.72 IC4.4 v56.52,45.72 | v153.67,29.21 151.92,29.21 150.81,30.32 129.54,30.32 128.43,29.21 IC1.13 122.56,29.21 121.92,29.84 120.49,29.84 120.17,29.53 104.78,29.53 104.3,29.05 97.16,29.05 v96.84,28.73
A7  (via drill 0.3)
  Top 0.254: CN1.R 52.07,88.58 55.88,84.77 55.88,80.96 57.31,79.53 57.31,63.98 55.88,62.55 55.88,48.26 v55.72,48.26 | v150.97,28.73 150.97,31.59 SV2.10 | v127.48,47.78 127.32,47.62 127.32,37.62 127.64,37.31 127.64,36.35 127.16,35.88 v127.16,26.67
  Bottom 0.254: v55.72,48.26 IC4.3 72.07,48.26 73.03,49.21 76.83,49.21 77.79,48.26 IC16.3 88.27,48.26 89.22,49.21 95.89,49.21 96.84,48.26 IC17.3 103.82,48.26 104.78,49.21 109.54,49.21 110.81,47.94 127.32,47.94 v127.48,47.78 | IC1.14 v127.16,26.67 127.95,26.67 129.54,28.26 150.5,28.26 v150.97,28.73
A8  (via drill 0.3)
  Top 0.254: CN1.P 49.53,88.9 46.99,86.36 v46.99,79.85 | v151.13,25.08 151.13,26.99 150.18,27.94 150.18,29.05 150.5,29.37 150.5,33.66 151.13,34.29 153.67,34.29 SV2.11 | v101.92,23.65 | v54.45,43.81 54.45,44.13 53.82,44.77 53.82,46.99 53.5,47.31 53.5,49.37 53.98,49.85 53.98,60.33 53.98,61.28 53.98,63.82 55.88,65.72 55.88,78.42 55.09,79.22 53.82,79.22 v53.18,79.85 | v134.94,45.72 | v134.94,45.72 134.78,45.88 134.78,66.36 135.57,67.15 135.57,80.33 133.35,82.55 133.35,85.88 135.73,88.27 135.73,92.87 135.41,93.19 132.24,93.19 132.08,93.03 IC13.14 | v101.92,23.65 102.08,23.65 v102.08,44.77
  Bottom 0.254: v151.13,25.08 137.79,25.08 136.84,24.13 IC1.15 121.44,24.13 120.81,24.77 109.7,24.77 109.38,24.45 105.41,24.45 104.62,23.65 v101.92,23.65 | v54.45,43.81 55.24,44.61 72.07,44.61 73.18,45.72 IC4.25 76.83,45.72 77.79,44.77 88.27,44.77 89.22,45.72 IC16.25 95.57,45.72 96.52,44.77 v102.08,44.77 103.82,44.77 104.78,45.72 IC17.25 v134.94,45.72 | v53.18,79.85 | v53.18,79.85 53.02,80.01 | 53.02,80.01 | 53.02,80.01 52.86,80.17 47.31,80.17 v46.99,79.85
A9  (via drill 0.3)
  Top 0.254: CN1.N 46.99,88.9 44.45,86.36 v44.45,80.01 | v150.02,22.54 150.02,27.46 149.7,27.78 149.7,29.37 150.02,29.69 150.02,34.29 151.29,35.56 SV2.12 | v106.36,21.59 106.2,21.75 106.2,42.39 107,43.18 IC17.24 | v54.45,41.91 54.45,42.86 53.82,43.5 53.82,44.13 53.34,44.61 53.34,46.83 53.02,47.15 53.02,49.53 53.5,50.01 53.5,63.98 55.4,65.88 55.4,78.26 54.93,78.74 53.02,78.74 v52.23,79.53 | v131.76,43.18 131.92,43.34 131.92,56.04 131.29,56.67 131.29,66.04 130.49,66.83 130.49,84.77 134.62,88.9 IC13.13
  Bottom 0.254: v150.02,22.54 138.27,22.54 137.32,21.59 IC1.16 v106.36,21.59 | v54.45,41.91 72.23,41.91 73.5,43.18 IC4.24 76.83,43.18 77.79,42.23 88.27,42.23 89.22,43.18 IC16.24 95.57,43.18 96.52,42.23 104.14,42.23 105.09,43.18 IC17.24 v131.76,43.18 | v52.23,79.53 52.07,79.69 47.94,79.69 47.31,79.06 45.4,79.06 v44.45,80.01
A10  (via drill 0.3)
  Top 0.254: CN1.M 44.45,88.9 41.91,86.36 41.91,74.77 39.69,72.55 39.69,37.15 v40.01,36.83 | v40.01,36.83 | v150.02,20 150.02,21.59 149.22,22.38 149.22,23.18 149.22,27.46 149.22,27.62 149.22,29.53 149.54,29.84 149.54,35.24 151.13,36.83 153.67,36.83 SV2.13 | v149.07,82.39 149.07,40.32 v148.91,40.16 | v112.55,35.56 | v112.55,35.56 112.39,35.4 112.39,28.57 112.87,28.1 112.87,27.78 112.24,27.15 112.24,19.37 v112.08,19.21
  Bottom 0.254: v150.02,20 136.84,20 135.89,19.05 IC1.17 122.71,19.05 122.56,19.21 v112.08,19.21 | IC13.2 129.54,82.07 129.7,81.92 148.59,81.92 v149.07,82.39 | v149.07,82.39 | v148.91,40.16 150.65,40.16 151.45,39.37 153.67,39.37 SV2.13 | v112.55,35.56 IC17.21 104.93,35.56 103.98,34.61 96.52,34.61 95.57,35.56 IC16.21 89.85,35.56 88.9,34.61 77.79,34.61 76.83,35.56 IC4.21 73.18,35.56 72.23,34.61 58.58,34.61 56.2,36.99 40.16,36.99 v40.01,36.83
A11  (via drill 0.3)
  Top 0.254: CN1.L 41.91,88.9 39.37,86.36 v39.37,80.49 | v150.02,17.46 150.02,18.89 149.38,19.53 149.38,21.59 148.75,22.23 148.75,29.84 149.07,30.16 149.07,36.2 150.81,37.94 152.24,37.94 SV2.14 | v106.2,16.51 106.2,20.8 105.57,21.43 105.57,29.21 104.78,30 104.78,35.24 105.41,35.88 v105.41,40.64 | v55.4,39.53 | v55.4,39.53 54.93,40.01 | 54.93,40.01 | 54.93,40.01 54.77,40.16 54.77,40.96 55.09,41.27 55.09,44.13 54.29,44.93 54.29,47.15 53.98,47.47 53.98,49.21 54.45,49.69 54.45,63.66 56.36,65.56 56.36,65.72 56.36,78.74 55.24,79.85 54.61,79.85 v53.98,80.49 | v132.24,40.16 132.4,40.32 132.4,56.2 131.76,56.83 131.76,66.2 130.97,66.99 130.97,82.71 IC13.3
  Bottom 0.254: 137.79,17.3 137,16.51 IC1.18 v106.2,16.51 | 137.79,17.3 | 137.79,17.3 137.95,17.46 v150.02,17.46 | v55.4,39.53 72.23,39.53 73.34,40.64 IC4.23 76.83,40.64 77.79,39.69 88.27,39.69 89.22,40.64 IC16.23 95.57,40.64 96.52,39.69 104.14,39.69 105.09,40.64 v105.41,40.64 IC17.23 111.44,40.64 111.76,40.32 112.39,40.32 112.55,40.48 131.92,40.48 | v53.98,80.49 53.82,80.64 39.53,80.64 v39.37,80.49 | 131.92,40.48 | 131.92,40.48 v132.24,40.16
A12  (via drill 0.3)
  Top 0.254: CN1.K 39.37,88.9 36.83,86.36 36.83,81.92 34.61,79.69 34.61,74.45 36.67,72.39 36.67,60.64 36.51,60.48 36.51,59.37 36.67,59.21 36.67,51.44 v36.35,51.12 | 105.41,72.39 v105.41,82.71 | v150.02,15.24 150.02,16.51 148.91,17.62 148.91,19.37 148.91,21.27 148.59,21.59 | 148.59,21.59 | 148.59,21.59 148.27,21.91 148.27,27.3 | 148.27,27.3 | 148.27,27.3 148.27,36.2 151.45,39.37 153.67,39.37 SV2.15 | 105.41,72.39 IC7.10 | 105.41,72.39 101.92,72.39 101.6,72.07 101.6,57.94 100.65,56.99 100.65,55.4 102.08,53.98 102.08,50.96 101.92,50.8 IC17.2 | v113.67,51.75 113.51,51.59 113.51,50.01 112.71,49.21 112.71,36.35 113.19,35.88 113.19,35.24 112.87,34.92 112.87,28.73 113.35,28.26 113.35,27.62 112.71,26.99 v112.71,13.97
  Bottom 0.254: IC7.27 85.09,83.66 85.72,83.03 105.09,83.03 v105.41,82.71 | v150.02,15.24 149.7,15.56 143.83,15.56 141.29,13.02 137.64,13.02 136.68,13.97 IC1.19 v112.71,13.97 | v113.67,51.75 113.51,51.91 103.35,51.91 102.23,50.8 IC17.2 96.84,50.8 95.89,51.75 89.22,51.75 88.27,50.8 IC16.2 77.79,50.8 76.83,51.75 73.03,51.75 72.07,50.8 IC4.2 57.31,50.8 56.67,51.44 36.67,51.44 v36.35,51.12
A13  (via drill 0.3)
  Top 0.254: IC17.26 109.54,48.26 109.86,47.94 v109.86,11.11 | v87.15,47.31 87.15,53.98 87.31,54.13 87.31,66.36 87,66.67 87.15,66.52 85.09,68.58 IC7.2 85.09,71.12 86.2,72.23 86.2,81.76 | v149.86,12.54 149.86,14.29 148.91,15.24 | 148.91,15.24 | 148.91,15.24 148.43,15.72 148.43,21.11 147.8,21.75 147.8,36.51 151.92,40.64 SV2.16 | v85.57,88.74 85.57,87.95 86.2,87.31 86.2,81.76 | v100.33,81.92 IC7.21 | 86.2,81.76 v85.88,81.76
  Bottom 0.254: IC17.26 104.78,48.26 103.82,47.31 96.84,47.31 95.89,48.26 IC16.26 89.38,48.26 88.42,47.31 v87.15,47.31 | v109.86,11.11 110.17,11.43 IC1.20 126.21,11.43 127.16,12.38 149.7,12.38 v149.86,12.54 | CN1.J 36.83,90.49 37.62,91.28 45.24,91.28 45.72,91.76 83.34,91.76 85.57,89.53 v85.57,88.74 | v100.33,81.92 | v100.33,81.92 100.17,82.07 86.2,82.07 v85.88,81.76
A14  (via drill 0.3)
  Top 0.254: v156.84,17.3 156.84,17.94 156.84,18.57 156.84,42.86 v157.16,43.18 | v87.79,53.34 87.79,68.26 87.63,68.42 IC7.3 87.63,71.28 86.68,72.23 86.68,88.58 v86.52,88.74 | v112.08,41.12 112.24,41.43 112.24,49.53 113.03,50.32 113.03,52.55 v112.87,52.7 | v86.52,88.74
  Bottom 0.254: IC16.1 v87.79,53.34 88.74,52.39 95.89,52.39 96.84,53.34 IC17.1 101.28,52.39 112.71,52.39 112.87,52.55 v112.87,52.7 | IC1.22 141.45,13.97 143.35,15.88 | 143.35,15.88 | 143.35,15.88 143.51,16.03 155.57,16.03 v156.84,17.3 | v157.16,43.18 SV2.17 153.67,41.91 142.4,41.91 141.45,40.96 112.24,40.96 v112.08,41.12 | CN1.H 34.29,90.96 35.08,91.76 44.93,91.76 45.4,92.23 83.5,92.23 86.52,89.22 v86.52,88.74
A15  (via drill 0.3)
  Top 0.254: CN1.F 31.75,88.9 29.21,86.36 v29.21,66.36 29.21,65.72 30.48,64.45 IC15.5 | v156.37,44.45 156.37,18.26 v156.05,17.94 | v149.7,44.13 149.7,44.29 149.54,44.45 149.54,69.85 v149.86,70.01 | IC7.4 90.17,67.31 v89.85,66.83
  Bottom 0.254: IC1.23 154.62,16.51 v156.05,17.94 | 152.4,44.45 v156.37,44.45 | 152.4,44.45 SV2.18 | 152.4,44.45 150.02,44.45 v149.7,44.13 | v149.86,70.01 149.54,70.33 137.79,70.33 137.16,69.69 IC27.5 137.16,67.63 136.37,66.83 117,66.83 116.84,66.99 90.01,66.99 v89.85,66.83 | v89.85,66.83 | v89.85,66.83 89.69,66.99 43.5,66.99 42.86,66.36 v29.21,66.36
AEC  (via drill 0.3, 0.32)
  Top 0.254: IC14.4 33.02,70.64 34.29,69.37 34.29,39.69 34.61,39.37 34.61,25.4 33.5,24.29 33.5,13.18 v33.97,12.7 | v81.12,11.91 | v81.12,11.91 81.28,11.75 81.28,6.35 SV3.21
  Bottom 0.254: v33.97,12.7 38.26,12.7 39.05,11.91 40.32,11.91 40.96,12.54 | 40.96,12.54 | 40.96,12.54 58.9,12.54 60.01,11.43 67.79,11.43 68.26,10.95 68.9,10.95 69.53,11.59 76.83,11.59 77.15,11.91 v81.12,11.91
BA  (via drill 0.3)
  Top 0.254: v43.18,96.2 v43.18,92.87 43.18,88.9 40.64,86.36 IC14.1 39.21,74.77 39.21,36.51 39.69,36.04 39.69,13.02 39.85,12.86 | SV3.11 68.58,6.35 v68.58,11.59 | v40.01,12.7 39.85,12.86 | 39.85,12.86
  Bottom 0.254: v43.18,96.2 43.5,96.52 46.99,96.52 CN1.12 | v43.18,92.87 43.81,92.23 44.61,92.23 45.09,92.71 83.66,92.71 87.63,88.74 IC7.26 | v68.58,11.59 68.26,11.91 60.17,11.91 59.05,13.02 40.32,13.02 v40.01,12.7
CAEC  (via drill 0.3)
  Top 0.254: IC14.6 v27.94,80.8 | v120.81,81.44 120.81,70.64 122.4,69.06 122.4,51.59 IC1.5
  Bottom 0.254: v27.94,80.8 | v27.94,80.8 28.1,80.96 32.38,80.96 32.54,80.8 33.66,80.8 34.45,81.6 85.09,81.6 85.41,81.28 85.57,81.12 86.36,81.12 86.84,81.6 92.87,81.6 93.66,80.8 100.81,80.8 101.12,81.12 120.49,81.12 v120.81,81.44
CASS_MOTOR  (via drill 0.3)
  Top 0.254: IC1.24 138.43,19.05 137.79,18.41 v137.79,6.35
  Bottom 0.254: SV1.1 v137.79,6.35
CASS_SENSE  (via drill 0.3)
  Top 0.254: v141.6,5.71 141.6,20.64 140.65,21.59 IC1.25 | RN3.5 92.71,61.91 92.71,55.72 94.46,53.98 v94.46,12.22 | v114.3,12.22 SV1.2
  Bottom 0.254: SV1.2 114.3,5.87 115.73,4.45 117.47,4.45 118.9,5.87 137.32,5.87 137.64,5.56 141.45,5.56 v141.6,5.71 | v94.46,12.22 v114.3,12.22
CASS_WRT  (via drill 0.3)
  Top 0.254: v142.56,5.71 142.56,6.03 142.08,6.51 142.08,23.34 141.29,24.13 IC1.26
  Bottom 0.254: SV1.3 111.76,6.19 113.98,3.97 117.63,3.97 119.06,5.4 137.16,5.4 137.64,4.92 141.92,4.92 142.56,5.56 v142.56,5.71
D0  (via drill 0.3)
  Top 0.254: CN1.21 69.85,94.77 68.74,93.66 | 68.74,93.66 | 68.74,93.66 68.58,93.5 68.58,87.31 69.22,86.68 69.22,82.39 71.91,79.69 71.91,30 v73.03,28.89 | v120.81,29.05 121.13,29.37 v121.13,53.02
  Bottom 0.254: SV2.23 153.67,52.07 IC1.37 136.68,52.07 135.57,53.18 121.28,53.18 v121.13,53.02 | v120.81,29.05 105.57,29.05 104.46,27.94 IC17.11 96.52,27.94 95.57,28.89 90.17,28.89 89.22,27.94 IC16.11 77.79,27.94 76.83,28.89 v73.03,28.89 72.07,27.94 IC4.11 57.31,27.94 56.67,27.3 56.67,26.99 53.98,24.29 13.49,24.29 9.84,27.94 SV4.5 | v121.13,53.02
D1  (via drill 0.3)
  Top 0.254: CN1.20 67.31,92.87 66.04,91.6 65.88,87.95 68.1,85.72 68.1,81.92 70.96,79.06 70.96,33.66 70.64,33.34 70.64,32.7 70.96,32.38 70.96,28.42 v73.03,26.35 | v121.28,26.99 121.6,27.3 121.6,48.26 v122.08,48.74 | v122.08,48.74
  Bottom 0.254: SV2.24 143.19,50.8 141.92,49.53 IC1.36 137.79,49.53 136.68,48.42 122.4,48.42 v122.08,48.74 | SV4.6 6.35,26.67 8.26,26.67 10.95,23.97 12.54,23.97 13.18,23.34 54.29,23.34 56.36,25.4 IC4.12 72.07,25.4 v73.03,26.35 76.83,26.35 77.79,25.4 IC16.12 89.22,25.4 90.17,26.35 95.57,26.35 96.52,25.4 IC17.12 104.3,25.4 105.25,26.35 120.65,26.35 v121.28,26.99 | v122.08,48.74
D2  (via drill 0.3)
  Top 0.254: v141.92,54.61 141.92,47.62 141.29,46.99 IC1.35 | v8.73,23.81 8.89,23.97 8.89,28.57 SV4.7 | CN1.19 64.77,93.03 63.5,91.76 63.5,88.74 67.15,85.09 67.15,81.28 70.01,78.42 70.01,36.51 69.53,36.04 69.53,35.24 70.17,34.61 70.17,32.38 70.48,32.07 70.48,26.35 v73.03,23.81 | v136.53,23.34 137,23.34 137.16,23.5 137.16,46.67 v136.84,46.99
  Bottom 0.254: SV2.25 153.67,54.61 v141.92,54.61 | v8.73,23.81 9.05,23.81 10,22.86 10.79,22.86 11.27,22.38 57.47,22.38 57.94,22.86 IC4.13 72.07,22.86 v73.03,23.81 76.83,23.81 77.79,22.86 IC16.13 89.22,22.86 90.17,23.81 95.57,23.81 96.52,22.86 IC17.13 104.46,22.86 105.57,23.97 120.65,23.97 121.44,23.18 136.37,23.18 v136.53,23.34 | v136.84,46.99 IC1.35
D3  (via drill 0.3)
  Top 0.254: IC1.34 140.97,44.45 142.56,46.04 v142.56,53.34 | v9.53,21.27 9.53,29.21 v9.37,29.37 | v62.55,21.11 62.07,21.59 62.07,59.85 62.23,60.01 62.23,60.96 61.44,61.75 61.44,86.36 60.8,87 60.8,91.44 62.23,92.87 CN1.18 | v136.68,20.8 136.68,21.11 135.41,22.38 135.41,24.13 136.21,24.92 136.21,41.27 135.89,41.59 135.89,43.97 v136.37,44.45
  Bottom 0.254: v142.56,53.34 SV2.26 | 62.39,21.43 10.95,21.43 10.79,21.27 v9.53,21.27 | 62.39,21.43 72.55,21.43 73.66,20.32 IC4.15 76.04,20.32 76.99,21.27 89.22,21.27 90.17,20.32 IC16.15 95.57,20.32 96.52,21.27 104.78,21.27 105.73,20.32 IC17.15 136.21,20.32 v136.68,20.8 | v9.37,29.37 6.19,29.37 SV4.8 | v62.55,21.11 62.55,21.27 62.39,21.43 | v136.37,44.45 IC1.34
D4  (via drill 0.3)
  Top 0.254: IC1.33 141.92,41.91 143.19,43.18 v143.19,57.15 | v10.32,22.07 10.32,31.75 10.79,32.23 10.79,33.66 v10.95,33.81 | CN1.17 59.69,96.04 60.01,96.36 63.02,96.36 63.34,96.04 63.34,93.34 61.23,91.18 61.23,87.2 61.91,86.52 61.91,85.88 | 61.91,85.88 61.91,61.91 62.55,61.28 62.71,61.12 62.71,59.69 62.55,59.53 62.55,22.7 v63.18,22.07 | 61.91,85.88 | v136.68,22.23 135.89,23.02 135.89,23.81 136.68,24.61 136.68,41.75 v136.53,41.91
  Bottom 0.254: v143.19,57.15 153.67,57.15 SV2.27 | 72.55,21.91 73.5,22.86 IC4.16 76.04,22.86 76.99,21.91 89.22,21.91 90.17,22.86 IC16.16 95.57,22.86 96.52,21.91 104.78,21.91 105.73,22.86 IC17.16 121.13,22.86 121.28,22.7 136.21,22.7 v136.68,22.23 | 72.55,21.91 71.91,21.91 | 63.18,21.91 10.64,21.91 v10.32,22.07 | 63.18,21.91 72.55,21.91 | v10.95,33.81 10.79,33.66 8.26,33.66 SV4.9 | 63.18,21.91 v63.18,22.07 | v136.53,41.91 IC1.33
D5  (via drill 0.3, 0.32)
  Top 0.254: v143.83,55.88 143.83,40.96 142.24,39.37 IC1.32 | CN1.16 57.15,94.14 58.42,92.87 58.42,87.15 59.69,85.88 59.69,62.71 v58.58,61.59 | v56.36,63.98 55.4,63.02 55.4,49.05 54.93,48.58 54.93,47.94 55.24,47.62 55.24,45.24 56.04,44.45 56.04,24.92 v56.52,24.45 | v135.57,28.89 135.73,29.05 135.73,39.05 v135.41,39.37 | v12.22,23.18 12.54,23.5 12.54,30.8 v12.22,31.11 | v12.22,31.11
  Bottom 0.254: v143.83,55.88 SV2.28 | SV4.10 5.08,32.86 6.19,31.75 9.05,31.75 9.53,31.27 12.06,31.27 v12.22,31.11 | v56.36,63.98 v58.58,61.59 | v135.57,28.89 135.41,28.73 129.22,28.73 128.11,27.62 123.03,27.62 120.81,25.4 IC17.17 105.41,25.4 104.46,24.45 96.52,24.45 95.57,25.4 IC16.17 90.17,25.4 89.22,24.45 77.79,24.45 76.83,25.4 IC4.17 73.03,25.4 72.07,24.45 v56.52,24.45 54.93,22.86 12.54,22.86 v12.22,23.18 | v135.41,39.37 IC1.32
D6  (via drill 0.3)
  Top 0.254: IC1.31 140.65,36.83 144.46,40.64 144.46,56.83 143.19,58.1 v143.19,59.37 | v11.11,24.77 10.79,25.08 10.79,31.59 11.27,32.07 11.27,33.02 11.75,33.5 11.75,34.29 11.43,34.61 v11.43,35.56 | CN1.15 54.61,94.14 55.88,92.87 55.88,87.15 57.78,85.25 57.78,81.76 58.74,80.8 58.74,63.5 57.31,62.07 57.31,27.3 v57.47,26.99 | v112.08,37.94 | v112.08,37.94 111.92,37.78 111.92,28.1 v112.08,27.94
  Bottom 0.254: v143.19,59.37 144.15,59.37 144.62,58.9 151.13,58.9 151.92,59.69 153.67,59.69 SV2.29 | 72.23,27.3 72.87,27.94 IC4.18 76.83,27.94 77.79,26.99 89.22,26.99 90.17,27.94 IC16.18 95.57,27.94 96.52,26.99 104.46,26.99 105.41,27.94 IC17.18 v112.08,27.94 | 72.23,27.3 | 72.07,27.15 72.23,27.3 | 72.07,27.15 | 72.07,27.15 71.91,26.99 v57.47,26.99 57.31,26.99 54.13,23.81 13.34,23.81 12.86,24.29 | v11.43,35.56 SV4.11 | IC1.31 127.64,36.83 126.68,37.78 112.24,37.78 v112.08,37.94 | 12.86,24.29 | 12.86,24.29 12.7,24.45 11.43,24.45 v11.11,24.77 | v11.11,24.77
D7  (via drill 0.3)
  Top 0.254: v143.83,58.42 144.94,57.31 144.94,39.53 IC1.30 | v11.43,29.37 11.27,29.53 11.27,31.43 11.75,31.91 11.75,32.86 12.22,33.34 12.22,35.72 11.59,36.35 v11.43,36.51 | CN1.14 52.07,94.14 53.34,92.87 53.34,88.11 56.52,84.93 56.52,81.28 57.63,80.17 57.78,80.01 57.78,63.82 56.36,62.39 56.36,46.67 55.72,46.04 55.72,45.4 56.52,44.61 56.52,29.53 v56.67,29.53 | 105.41,34.77 | 105.41,34.77 v105.57,34.92 | v105.41,30.48 105.41,34.77
  Bottom 0.254: IC17.19 v105.41,30.48 105.09,30.48 104.14,29.53 96.52,29.53 95.57,30.48 IC16.19 90.17,30.48 89.22,29.53 77.79,29.53 76.83,30.48 IC4.19 72.87,30.48 72.07,29.69 | v143.83,58.42 SV2.30 | 72.07,29.69 | 72.07,29.69 71.91,29.53 v56.67,29.53 | v11.43,29.37 11.59,29.37 56.52,29.37 v56.67,29.53 | v56.67,29.53 | v11.43,29.37 | v11.43,36.51 11.11,36.83 6.35,36.83 SV4.12 | IC1.30 134.14,34.29 133.03,35.4 117,35.4 116.2,34.61 105.73,34.61 v105.57,34.92
DOTCLK  (via drill 0.3)
  Top 0.254: SV3.19 78.74,6.35 78.74,11.27 v78.58,11.27 | v32.23,12.86 32.07,13.02 32.07,13.18 32.54,13.65 32.54,24.45 32.07,24.92 32.07,38.89 32.07,39.21 32.07,80.96 30.48,82.55 30.48,86.36 33.02,88.9 33.02,93.98 CN1.6
  Bottom 0.254: v78.58,11.27 | v78.58,11.27 78.42,11.43 77.31,11.43 76.99,11.11 69.69,11.11 69.22,10.64 | 69.22,10.64 | 69.22,10.64 69.06,10.48 68.1,10.48 67.63,10.95 59.85,10.95 58.74,12.06 41.12,12.06 40.48,11.43 38.73,11.43 38.26,11.91 33.18,11.91 32.38,12.7 | 32.38,12.7 | v32.23,12.86 32.38,12.7
GND  (via drill 0.6)
  other vias: 80.49,96.2 69.22,20.32 65.41,73.03 78.74,76.2 115.57,76.2 147.32,64.77 48.26,61.59 15.24,6.51 76.83,87 81.28,64.14 117.47,17.78 117.63,62.23 1.91,60.96 17.78,28.1 85.72,96.2 97.79,76.2 123.19,88.58 129.54,62.87 48.26,56.52 125.09,65.41 117.63,53.98 129.54,50.8 18.57,40.64 48.42,27.62
  pour Bottom: 0,100.33 160.02,100.33 160.02,0 0,0
  pour Top: 0,100.33 160.02,100.33 160.02,0 0,0
GR/W  (via drill 0.3)
  Top 0.254: v113.51,12.86 113.51,14.29 113.19,14.61 113.19,26.83 113.82,27.46 113.82,28.42 113.35,28.89 113.35,34.77 113.67,35.08 113.67,36.04 113.19,36.51 113.19,49.05 113.98,49.85 113.98,50.8 114.3,51.12 114.3,68.58 IC7.13 | SV3.20 v80.01,12.7
  Bottom 0.254: v80.01,12.7 80.17,12.86 v113.51,12.86
I/O1
  Bottom 0.254: CN1.7 35.24,94.3 35.4,94.14 84.14,94.14 88.74,89.53 129.22,89.53 129.7,89.06 141.76,89.06 142.08,88.74 142.72,88.74 143.19,89.22 143.19,90.49 IC13.10
I/O2
  Bottom 0.254: CN1.10 41.43,95.25 40.32,96.36 40.32,97.31 40.64,97.63 72.23,97.63 73.82,96.04 73.82,94.61 84.3,94.61 88.9,90.01 122.08,90.01 125.41,93.34 144.15,93.34 144.62,92.87 144.62,91.6 IC13.9
N$2
  Bottom 0.254: IC2.11 IC2.12
N$3  (via drill 0.32)
  Top 0.254: IC27.2 129.54,71.91 v129.7,72.07 | v75.09,75.25 75.88,74.45 75.88,73.82 75.41,73.34 75.41,58.42 77.15,56.67 77.15,40.16 v76.68,39.69 | v23.97,39.69 23.97,28.1 IC2.8
  Bottom 0.254: v129.7,72.07 129.38,71.75 124.3,71.75 123.35,72.71 122.56,72.71 122.08,72.23 118.43,72.23 117.32,73.34 114.3,73.34 113.51,74.14 | 113.51,74.14 | 113.51,74.14 113.35,74.3 112.71,74.3 112.24,73.82 109.22,73.82 108.9,74.14 101.92,74.14 101.28,74.77 94.61,74.77 94.3,74.45 83.66,74.45 83.5,74.61 75.72,74.61 v75.09,75.25 | v76.68,39.69 | v76.68,39.69 76.52,39.53 72.87,39.53 72.39,39.05 57.63,39.05 57.47,38.89 24.77,38.89 v23.97,39.69
N$4
  Top 0.254: IC2.13 38.1,21.27 C5.2
  Bottom 0.254: C5.2 36.51,20.95 31.59,20.95 R2.2
N$5  (via drill 0.32)
  Top 0.254: IC2.10 30.48,31.43 29.37,32.54 29.37,43.5 31.59,45.72 31.59,49.21 29.53,51.28 29.53,64.61 28.26,65.88 v28.26,66.52
  Bottom 0.254: IC27.1 125.73,67.31 117.32,67.31 117.16,67.47 43.34,67.47 42.7,66.83 29.84,66.83 29.53,67.15 28.89,67.15 v28.26,66.52 | IC2.10 30.48,25.4 29.84,24.77 19.05,24.77 R1.1
N$6
  Top 0.254: R1.2 C4.2
  Bottom 0.254: IC2.9 27.94,28.57 27.62,28.89 20.95,28.89 C4.2
N$7
  Bottom 0.254: IC15.9 IC15.10
N$16  (via drill 0.3)
  Top 0.254: v21.59,5.71 v21.59,51.91
  Bottom 0.254: IC4.1 58.1,53.34 56.67,51.91 v21.59,51.91 | v21.59,5.71 | v21.59,5.71 JP2.2
N$17  (via drill 0.32)
  Top 0.254: v22.07,3.17 22.07,5.08 22.38,5.4 22.38,6.03 22.07,6.35 22.07,40.32 v22.38,40.64
  Bottom 0.254: v22.07,3.17 JP2.1 | v22.38,40.64 IC12.8
N$23  (via drill 0.3)  (1 unrouted)
  Top 0.254: IC12.6 27.94,45.09 26.51,43.66 26.51,37.31 26.51,36.99 v26.51,4.45
  Bottom 0.254: JP1.1 36.83,4.45 27.46,4.45 v26.51,4.45
PHI0  (via drill 0.3)
  Top 0.254: v63.34,59.85 63.34,59.69 63.02,59.37 63.02,23.18 63.82,22.38 63.82,21.11 v63.5,20.8 | SV3.10 66.67,8.26 v66.67,20.8
  Bottom 0.254: v63.34,59.85 63.5,60.01 122.71,60.01 123.03,59.69 IC1.1 | v66.67,20.8 66.52,20.95 63.66,20.95 v63.5,20.8
PHI2  (via drill 0.3)
  Top 0.254: v12.7,16.19 13.02,16.51 13.02,46.2 12.86,46.35 12.86,50.48 v12.54,50.8 11.91,51.44 11.91,87.31 v11.43,87.79 | v69.85,14.45 v69.85,16.83 | v136.21,14.92 136.21,20.32 135.89,20.64 135.89,21.11 134.94,22.07 134.94,27.62 133.35,29.21 133.35,34.61 132.87,35.08 132.87,56.83 v132.56,57.15
  Bottom 0.254: v69.85,14.45 69.53,14.76 65.41,14.76 64.93,15.24 61.75,15.24 61.12,15.88 14.92,15.88 14.61,16.19 v12.7,16.19 | v12.54,50.8 SV4.23 | CN1.E 29.21,89.22 28.1,88.11 13.02,88.11 12.7,87.79 v11.43,87.79 | v69.85,16.83 70.8,16.83 71.12,17.14 71.75,17.14 72.55,16.35 75.41,16.35 75.88,15.88 83.5,15.88 84.14,15.24 86.52,15.24 86.68,15.4 87.47,15.4 88.27,14.61 108.27,14.61 108.74,15.08 112.71,15.08 113.35,14.45 122.87,14.45 123.35,14.92 v136.21,14.92 | v132.56,57.15 IC1.39
POTX  (via drill 0.3)
  Top 0.254: v72.39,13.34 SV3.14 | v13.97,13.97 14.76,14.76 14.76,15.4 14.45,15.72 14.45,46.35 14.76,46.67 14.76,47.47 14.13,48.1 14.13,52.39 14.13,53.02 14.13,54.93 v13.18,55.88
  Bottom 0.254: v72.39,13.34 60.64,13.34 59.53,14.45 14.45,14.45 v13.97,13.97 | v13.18,55.88 SV4.27
POTY  (via drill 0.3)
  Top 0.254: v74.93,13.34 SV3.16 | v15.24,16.67 14.92,16.99 14.92,46.2 15.08,46.35 | 15.08,46.35 | 15.08,46.35 15.24,46.51 15.24,47.78 14.61,48.42 14.61,57.15 v13.34,58.42
  Bottom 0.254: v74.93,13.34 74.93,13.81 74.3,14.45 70.96,14.45 70.17,15.24 65.56,15.24 65.09,15.72 62.07,15.72 61.44,16.35 15.56,16.35 v15.24,16.67 | v13.34,58.42 SV4.29
R/W  (via drill 0.3, 0.32)
  Top 0.254: 90.81,58.74 90.81,57.47 90.49,57.15 90.49,56.04 90.81,55.72 v90.81,15.24 | 90.81,58.74 90.81,66.99 91.44,67.63 91.44,79.69 92.71,80.96 IC7.24 R33.1 | v27.78,43.66 29.05,44.93 29.05,60.01 v28.73,60.33 29.05,60.64 29.05,63.66 26.99,65.72 26.99,85.25 30.48,88.74 30.48,93.98 CN1.5 | SV3.3 59.69,5.4 58.42,6.67 58.42,10.16 v57.31,11.27 | v32.23,11.91 31.91,12.22 31.59,12.54 31.59,13.49 32.07,13.97 32.07,21.59 | 32.07,21.59 32.07,24.13 31.59,24.61 31.59,38.89 31.59,39.21 31.59,43.34 v31.27,43.66 | v57.31,11.27 v57.31,18.1 | v57.31,11.27 | 90.81,58.74 v90.01,58.74 | R2.1 29.53,20.32 30.8,21.59 32.07,21.59
  Bottom 0.254: SV4.16 6.35,41.91 24.45,41.91 25.88,43.34 27.46,43.34 v27.78,43.66 v31.27,43.66 | v57.31,11.27 56.99,11.59 41.27,11.59 40.64,10.95 38.58,10.95 38.1,11.43 32.7,11.43 v32.23,11.91 | v57.31,18.1 57.63,17.78 62.39,17.78 63.02,17.14 65.88,17.14 66.36,16.67 68.74,16.67 69.69,17.62 71.91,17.62 72.71,16.83 75.56,16.83 76.04,16.35 83.66,16.35 84.3,15.72 86.36,15.72 86.52,15.88 87.79,15.88 88.58,15.08 90.65,15.08 v90.81,15.24 | IC15.1 40.64,60.8 40.32,60.48 28.89,60.48 v28.73,60.33 | IC1.38 128.11,54.61 126.68,56.04 122.87,56.04 119.86,59.05 90.33,59.05 v90.01,58.74
RDY  (via drill 0.3)  (1 unrouted)
  Top 0.254: v37.15,59.69 37.15,72.55 35.56,74.14 IC14.3
  Bottom 0.254: IC1.2 122.56,57.15 120.17,59.53 63.98,59.53 63.66,59.21 63.02,59.21 62.55,59.69 | 62.55,59.69 | 62.55,59.69 62.39,59.85 37.31,59.85 v37.15,59.69
ROM_A13  (via drill 0.3)
  Top 0.254: v22.86,6.99 | v22.86,6.99 22.54,7.3 22.54,39.53 23.18,40.16 23.18,40.96 22.07,42.07 22.07,45.88 v22.38,46.2 | v22.38,46.2
  Bottom 0.254: IC4.26 73.34,48.26 72.39,47.31 47.47,47.31 45.24,45.09 32.86,45.09 31.75,46.2 26.04,46.2 v22.38,46.2 | v22.86,6.99 36.83,6.99 JP1.2
ROW4  (via drill 0.3)
  Top 0.254: v82.55,14.13 SV3.22 | v15.88,17.3 15.4,17.78 15.4,45.88 15.72,46.2 15.72,48.1 15.08,48.74 15.08,49.05 15.08,49.37 15.08,59.21 v13.34,60.96
  Bottom 0.254: v82.55,14.13 75.41,14.13 74.61,14.92 71.28,14.92 70.48,15.72 65.72,15.72 65.25,16.19 62.39,16.19 61.75,16.83 16.35,16.83 v15.88,17.3 | v13.34,60.96 SV4.31
VCC  (via drill 0.6, 0.9)
  Top 0.254: RN1.1 25.4,93.98 CN1.3 | IC12.9 27.94,42.7 30.48,45.24 IC12.5
  Top 0.406: RN3.1 102.87,59.69 106.05,56.52 C20.1
  Top 0.61: v111.12,46.99 v111.12,9.05
  Top 0.813: 42.86,40.64 42.86,47.31 | 42.86,47.31 42.86,54.61 | 42.86,54.61 IC15.14 | 42.86,54.61 42.86,66.36 IC14.14 | C26.1 43.18,46.99 42.86,47.31 | IC2.14 41.91,26.67 42.86,27.62 42.86,40.64 | 42.86,40.64 IC12.14
  Top 1.27: 127,98.11 IC13.16 126.68,91.44 125.09,89.85 125.09,78.74 | 125.09,78.74 125.09,78.11 IC27.14 | C28.1 15.24,97.79 14.92,98.11 | 21.59,98.11 CN1.2 | 24.13,98.11 CN1.3 | 125.09,78.74 C34.1 | v111.12,46.99 111.12,52.39 110.17,53.34 IC17.28 | C29.1 157.64,66.83 158.12,67.31
  Top 1.422: C1.+ 108.74,94.61 108.74,98.11
  Top 1.676: SV2.32 SV2.31 SV2.33 | SV2.33 158.12,63.5 158.12,67.31 158.12,90.17 153.03,90.17 149.86,93.34 149.86,98.11 127,98.11 108.74,98.11 99.06,98.11 99.06,93.03 96.2,90.17 91.76,90.17 88.9,93.03 88.9,98.11 82.55,98.11 | SV2.33 SV2.34 | 82.55,98.11 24.13,98.11 21.59,98.11 14.92,98.11 10.16,98.11 10.16,93.03 7.3,90.17 1.91,90.17 1.91,70.33 | 1.91,70.33 1.91,66.67 SV4.34 | SV4.34 SV4.33 | SV4.34 SV4.32 | IC7.28 R33.2 82.55,98.11 | IC4.28 74.93,56.52 C19.1 v73.66,68.9 v73.66,85.09 | C2.+ 2.06,70.48 1.91,70.33
  Bottom 0.254: IC12.14 40.64,42.07 39.53,43.18 35.08,43.18 34.77,42.86 30.16,42.86 IC12.9
  Bottom 0.61: v111.12,9.05 107.31,9.05 106.68,8.41 SV1.5
  Bottom 0.813: C6.1 42.7,27.46 41.91,26.67 IC2.14
  Bottom 1.27: IC4.28 74.93,53.66 76.2,54.93 91.44,54.93 | 91.44,54.93 92.71,54.93 | 92.71,54.93 IC16.28 | 92.71,54.93 106.36,54.93 106.68,54.61 | IC14.14 44.45,68.58 C25.1 63.18,69.85 64.14,68.9 v73.66,68.9 | IC1.6 C30.1 v111.12,46.99 | 106.68,54.61 C20.1 | 106.68,54.61 IC17.28 | 91.44,54.93 C3.1
  Bottom 1.676: IC7.28 C27.1 v73.66,85.09

## Text on the board
tPlace: EXPANSION PORT | ROM | RAM | RAM | CPU | CASSETTE | KERNAL | SPC64 1.1 2019-2020